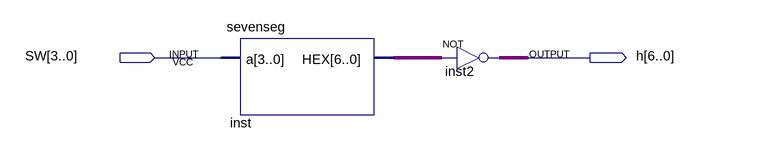
[diagram p0: schematic sheet]
// Quartus schematic top3.bdf as structural Verilog: 2 symbols, 2 pins
module top3 (
  input  [3:0] SW,
  output [6:0] h
);

  wire [6:0] inst_hex;

  sevenseg inst (.a(SW), .HEX(inst_hex));
  assign h = ~inst_hex;  // NOT inst2, 7 bits wide
endmodule
